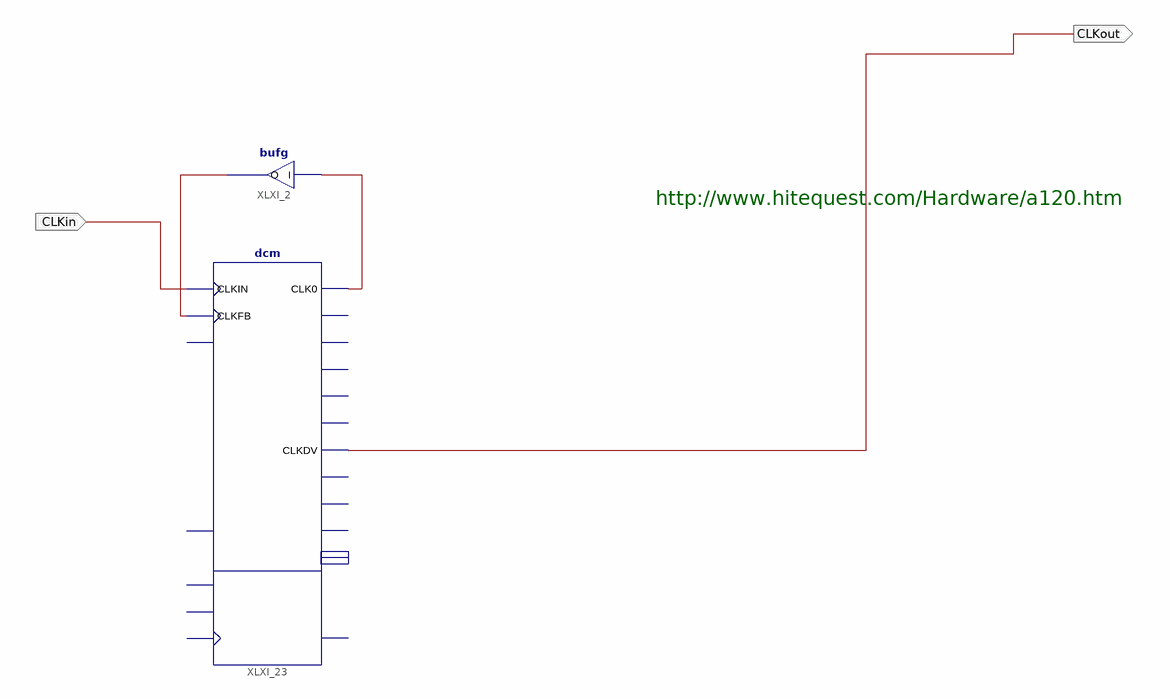
[diagram p0: schematic sheet 1]
// Xilinx ISE schematic divideby3.sch (spartan3e) as structural Verilog: 2 symbols, 2 ports
module divideby3 (
  input  CLKin,
  output CLKout
);

  wire XLXN_24, XLXN_25;

  dcm #(.CLKDV_DIVIDE(3)) XLXI_23 (
    .CLKFB(XLXN_25), .CLKIN(CLKin), .CLK0(XLXN_24), .CLKDV(CLKout));  // open: DSSEN, PSCLK, PSEN, PSINCDEC, RST, CLK180, CLK270, CLK2X, CLK2X180, CLK90, CLKFX, CLKFX180, LOCKED, PSDONE, STATUS
  bufg XLXI_2 (.I(XLXN_24), .O(XLXN_25));

  // Notes on the sheet:
  //   http://www.hitequest.com/Hardware/a120.htm
endmodule
